# EAGLE design 205-020_001 smps_boost_fromCell (EAGLE 7.6.0)
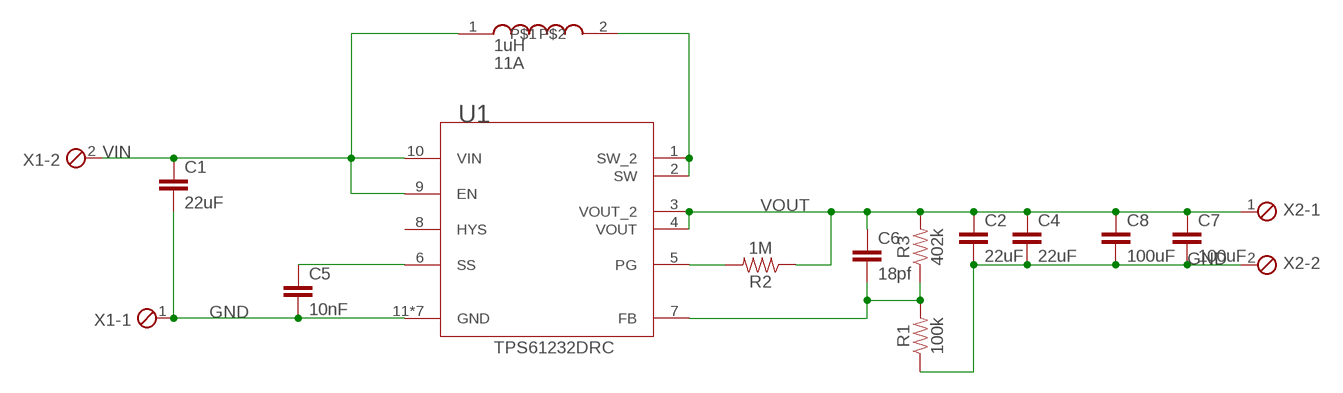
[diagram p0: schematic, sheet 1]

## Parts
C1  22uF  22UF-0805-16V-20%  [0805]
C2  22uF  22UF-0805-16V-20%  [0805]
C4  22uF  22UF-0805-16V-20%  [0805]
C5  10nF  10NF-0603-50V-10%  [0603]
C6  18pf  CAP-0805  [0805]
C7  100uF  CAP-1206  [1206]
C8  100uF  CAP-1206  [1206]
R1  100k  100KOHM-0603-1/10W-1%  [0603]
R2  1M  1MOHM-0603-1/4W-5%  [0603]
R3  402k  100KOHM-0603-1/10W-1%  [0603]
U1  TPS61232DRCR  [DRC0010G]
U$1  1uH  LMLP0707  [07A7]
X1  MPT2  [2POL254]
X2  MPT2  [2POL254]

## Nets
GND: C1.2 C2.2 C4.2 C5.2 C7.2 C8.2 R1.1 U1.11(GND) U1.11A(GND) U1.11B(GND) U1.11C(GND) U1.11D(GND) U1.11E(GND) U1.11F(GND) X1.1 X2.2
N$1: U1.1(SW_2) U1.2(SW) U$1.2
N$3: C5.1 U1.6(SS)
N$4: R2.2 U1.5(PG)
N$6: C6.2 R1.2 R3.1 U1.7(FB)
VIN: C1.1 U1.9(EN) U1.10(VIN) U$1.1 X1.2
VOUT: C2.1 C4.1 C6.1 C7.1 C8.1 R2.1 R3.2 U1.3(VOUT_2) U1.4(VOUT) X2.1
Unconnected: U1.8(HYS)

## Library data of the parts
C1 C2 C4 = SparkFun-Capacitors:22UF: 22µF ceramic capacitors A capacitor is a passive two-terminal electrical component used to store electrical energy temporarily in an electric field.; PROD_ID: CAP-14260
C5 = SparkFun-Capacitors:10NF: 0.01uF/10nF/10,000pF ceramic capacitors A capacitor is a passive two-terminal electrical component used to store electrical energy temporarily in an electric field. CAP-09321; PROD_ID: CAP-00867
C6-C8 = SparkFun-Capacitors:CAP
R1 = SparkFun-Resistors:100KOHM: 100kΩ resistor A resistor is a passive two-terminal electrical component that implements electrical resistance as a circuit element. Resistors act to reduce current flow, and, at the same time, act to lower voltage levels within circuits. - Wikipedia; PROD_ID: RES-07828
R2 = SparkFun-Resistors:1MOHM: 1MΩ resistor A resistor is a passive two-terminal electrical component that implements electrical resistance as a circuit element. Resistors act to reduce current flow, and, at the same time, act to lower voltage levels within circuits. - Wikipedia; PROD_ID: RES-07868
R3 = SparkFun-Resistors:100KOHM: 100kΩ resistor A resistor is a passive two-terminal electrical component that implements electrical resistance as a circuit element. Resistors act to reduce current flow, and, at the same time, act to lower voltage levels within circuits. - Wikipedia; PROD_ID: RES-07828; VALUE: 100k
U1 = texas:TPS61232DRCR; ADDRESS1: Not shown in title block; ADDRESS2: Not shown in title block; ADDRESS3: Not shown in title block; ADDRESS4: Not shown in title block; ALTERNATE_MANUFACTURER: None; APPROVEDBY: Not shown in title block; AUTHOR: Not shown in title block; CHECKEDBY: Not shown in title block; COMPANYNAME: Not shown in title block; COMPONENTLINK1DESCRIPTION: Datasheet Link; COMPONENTLINK1URL: https://sps06.itg.ti.com/sites/KMS/crossdivteams/altium/docs/ComponentDatasheets/TPS61230_SLVSAQ2_Jan 2014_preliminary.pdf; COMPTYPE: IC; CURRENTDATE: Not shown in title block; CURRENTTIME: Not shown in title block; DATE: Not shown in title block; DESIGNATOR: U?; DOCUMENTFULLPATHANDNAME: Not shown in title block; DOCUMENTNAME: Not shown in title block; DOCUMENTNUMBER: 1; ENGINEER: Not shown in title block; IMAGEPATH: Not shown in title block; LATESTREVISIONDATE: 2014-03-12; MANUFACTURER: Texas Instruments; MODIFIEDDATE: Not shown in title block; MOUNTTYPE: SMT; ORGANIZATION: Not shown in title block; PACKAGEREFERENCE: DRC0010G; PARTNUMBER: TPS61232DRC; PIN_COUNT: 11; PROJECTNAME: *; PUBLISHER: Texas Instruments; REVISION: Use project parameter SCH_Rev; ROHS: Y; RULE: *; SHEETNUMBER: 1; SHEETTOTAL: 1; SYMBOLCREATOR: a0411947; SYMBOLVERSION: 2014-03-05; TIME: Not shown in title block; U-M: EA
U$1 = cs_inductors:LMLP0707; CURRENT: 11A; INDUCTANCE: 1uH
X1 X2 = con-phoenix-254:MPT2: PHOENIX CONNECTOR; OC_FARNELL: unknown; OC_NEWARK: unknown

## Board
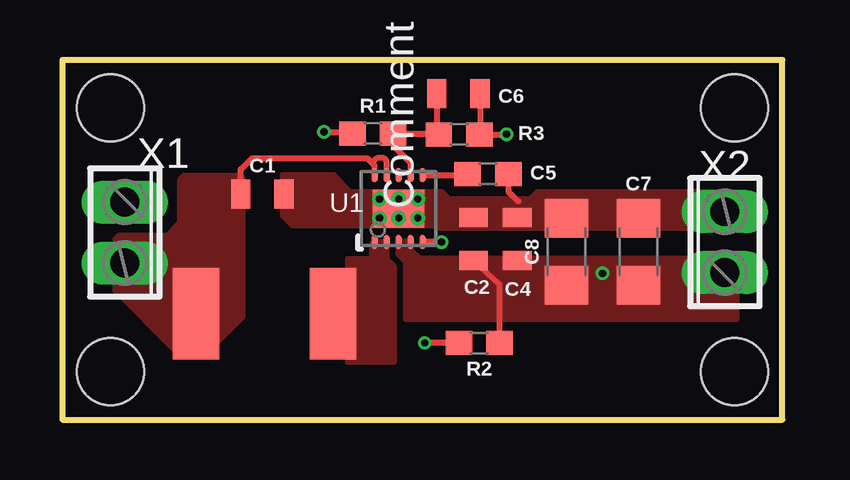
[diagram p1: board, top side]
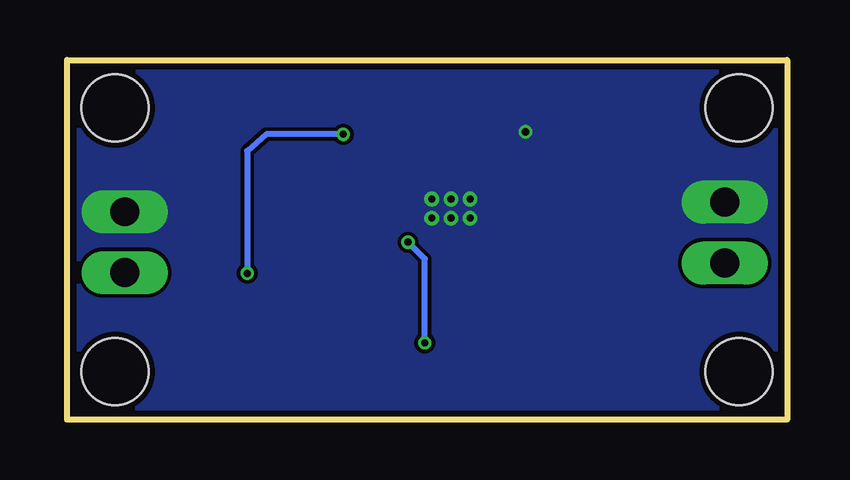
[diagram p2: board, bottom side, seen from below]

Size 30 x 15 mm. Coordinates in mm from the lower left corner, seen from the top.
Outline: 0,0 30,0 30,15 0,15 0,0
Copper layers (1*16): Top 0.035mm / dielectric 1.5mm / Bottom 0.035mm
Design rules "default *": minimum track width 6mil, minimum drill 10mil, track to track 6mil, track to pad 6mil, pad to pad 6mil, via to via 6mil, smd to smd 6mil, copper to edge 10mil, drill to drill 6mil, minimum pad ring 5mil, minimum via ring 5mil, stop-mask expansion 4mil, vias tented up to drill 0mil, thermal gap 10mil
Holes 2.8 mm at 2,13 2,2 28,2 28,13

### Footprints (pad centres in the part's own frame; a part is rotated, then mirrored left to right if it is on the bottom)
0805 = smd 0.8 x 1.2: 1 -0.9,0; 2 0.9,0
0603 = smd 1.1 x 1: 1 -0.85,0; 2 0.85,0
1206 = smd 1.6 x 1.8: 1 -1.4,0; 2 1.4,0
DRC0010G = smd 0.6 x 0.24: 1 -1.4,1; 2 -1.4,0.5; 3 -1.4,0; 4 -1.4,-0.5; 5 -1.4,-1; 6 1.4,-1; 7 1.4,-0.5; 8 1.4,0; 9 1.4,0.5; 10 1.4,1 | smd 1.6 x 2.15: 11 0,0 | drill 0.3 pad 0.61: 11A -0.4,0.8; 11B 0.4,0.8; 11C -0.4,0; 11D 0.4,0; 11E -0.4,-0.8; 11F 0.4,-0.8
07A7 = smd 1.93 x 3.81: 1 0,0; 2 5.715,0
2POL254 = drill 1.2 long: 1 -1.27,0; 2 1.27,0

### Placement (x,y rotation side)
C1  8.33,9.41 0 top
C2  17.13,7.53 90 top
C4  18.95,7.53 90 top
C5  17.73,10.24 0 top
C6  16.5,13.6 180 top
C7  24,7 90 top
C8  21,7 90 top
R1  12.93,11.93 0 top
R2  17.37,3.2 180 top
R3  16.53,11.89 0 top
U1  14.01,8.8 90 top
U$1  5.56,4.42 0 top
X1  2.6,7.8 270 top
X2  27.6,7.4 90 top

### Tracks (layer width: path | path; a pad name or v marks a point on that pad's centre or on a via)
GND  (via drill 0.3)
  Top 0.254: C5.2 18.58,9.52 19,9.1 | v10.9,12 12.01,12 R1.1
  pour Bottom (no thermals): 0,0 30,0 30,15 0,15
  pour Top (no thermals): 28,8 15.7,8 15.6,8.1 9.6,8.1 9.2,8.5 9.2,10.2 11.3,10.2 12,9.5 15.8,9.5 16.1,9.2 19.5,9.2 19.8,9.5 28,9.5
N$1
  pour Top (no thermals): 11.9,2.4 11.9,6.7 12.9,6.7 12.9,7.3 13,7.4 13.5,7.4 13.5,6.7 13.8,6.4 13.8,2.4
N$3
  Top 0.254: U1.6 16.84,10.2 C5.1
N$4  (via drill 0.3)
  Top 0.254: R2.2 v15.1,3.2 | v15.8,7.4 U1.5
  Bottom 0.254: v15.1,3.2 15.1,6.7 v15.8,7.4
N$6
  Top 0.254: U1.7 14.51,10.69 13.8,11.4 13.8,11.91 R1.2 15.64,11.93 R3.1 15.6,11.97 C6.2
VIN
  Top 0.254: C1.1 7.43,10.43 7.9,10.9 12.7,10.9 12.9,10.7 | 12.9,10.7 13,10.6 U1.10 | U1.9 13.51,10.79 13.4,10.9 13.1,10.9 12.9,10.7
  pour Top (no thermals): 6,3 4.7,3 2.3,5.4 2.3,7.5 2.4,7.6 4.4,7.6 5,8.2 5,10 5.1,10.1 7.4,10.1 7.4,4.3 6.1,3
VOUT  (via drill 0.3)
  Top 0.254: R2.1 18.22,5.64 C2.1 | C6.1 17.4,11.91 R3.2 v18.49,11.89 v18.5,11.9
  Bottom 0.254: v18.5,11.9 21.7,11.9 22.5,11.2 v22.5,6.1
  pour Top (no thermals): 14,7.4 14,6.9 14.3,6.6 14.3,4.2 28.1,4.2 28.1,6.7 14.9,6.7 14.5,7.1 14.5,7.4